# EAGLE design gluecksrad (EAGLE 6.6.0)
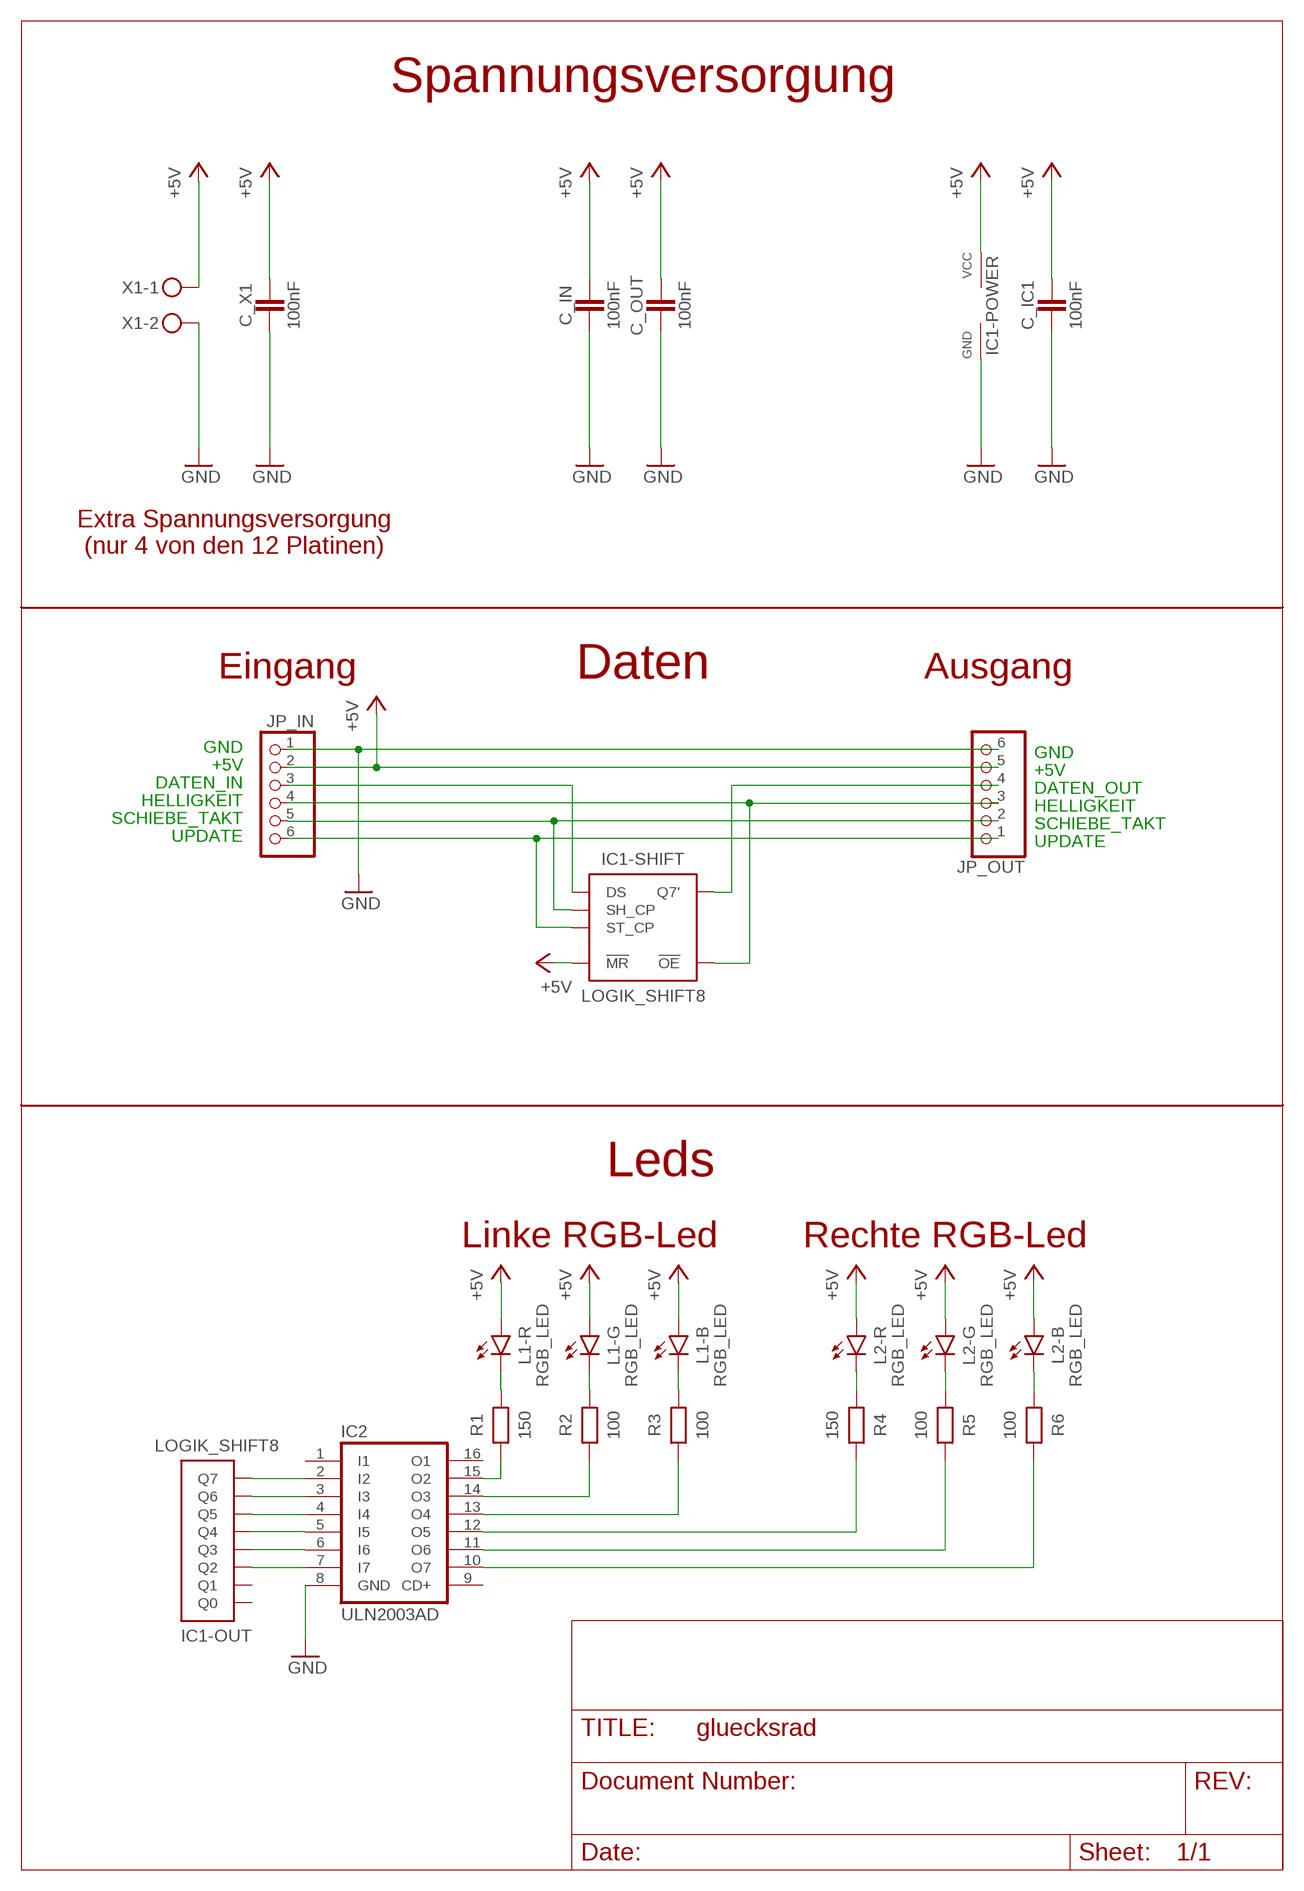
[diagram p0: schematic, sheet 1]

## Parts
C_IC1  100nF  CAPACITATOR-2,5MM  [C_THT_2]
C_IN  100nF  CAPACITATOR-2,5MM  [C_THT_2]
C_OUT  100nF  CAPACITATOR-2,5MM  [C_THT_2]
C_X1  100nF  CAPACITATOR-2,5MM  [C_THT_2]
IC1  LOGIK_SHIFT8  [IC_SOIC16]
IC2  ULN2003AD  [SO16]
JP_IN  PINHD-1X6/90  [1X06/90]
JP_OUT  PINHD-1X6/90  [1X06/90]
L1  RGB_LED  LED_3X  [LED_TOP_PLCC6]
L2  RGB_LED  LED_3X  [LED_TOP_PLCC6]
R1  150  RESISTOR-10MM  [R_THT_4]
R2  100  RESISTOR-10MM  [R_THT_4]
R3  100  RESISTOR-10MM  [R_THT_4]
R4  150  RESISTOR-10MM  [R_THT_4]
R5  100  RESISTOR-10MM  [R_THT_4]
R6  100  RESISTOR-10MM  [R_THT_4]
X1  STECKER_SPG_2  [STECKER_SPG_2]

## Nets
+5V: C_IC1.1 C_IN.1 C_OUT.1 C_X1.1 IC1.P$10(-SHIFT:!MR) IC1.P$16(-POWER:VCC) JP_IN.2 JP_OUT.5 L1.1(-R:A) L1.3(-G:A) L1.4(-B:A) L2.1(-R:A) L2.3(-G:A) L2.4(-B:A) X1.1
DATEN_IN: IC1.P$14(-SHIFT:DS) JP_IN.3
DATEN_OUT: IC1.P$9(-SHIFT:Q7') JP_OUT.4
GND: C_IC1.2 C_IN.2 C_OUT.2 C_X1.2 IC1.P$8(-POWER:GND) IC2.8(GND) JP_IN.1 JP_OUT.6 X1.2
HELLIGKEIT: IC1.P$13(-SHIFT:!OE) JP_IN.4 JP_OUT.3
N$1: IC1.P$5(-OUT:Q5) IC2.4(I4)
N$2: IC1.P$6(-OUT:Q6) IC2.3(I3)
N$3: IC1.P$2(-OUT:Q2) IC2.7(I7)
N$4: IC1.P$7(-OUT:Q7) IC2.2(I2)
N$5: IC1.P$3(-OUT:Q3) IC2.6(I6)
N$6: IC2.15(O2) R1.2
N$7: IC2.14(O3) R2.2
N$8: IC2.13(O4) R3.2
N$9: IC2.12(O5) R4.1
N$10: IC2.11(O6) R5.1
N$11: IC2.10(O7) R6.1
N$12: L1.6(-R:C) R1.1
N$13: L1.2(-G:C) R2.1
N$14: L1.5(-B:C) R3.1
N$15: L2.6(-R:C) R4.2
N$16: L2.2(-G:C) R5.2
N$17: L2.5(-B:C) R6.2
N$18: IC1.P$4(-OUT:Q4) IC2.5(I5)
SCHIEBE_TAKT: IC1.P$11(-SHIFT:SH_CP) JP_IN.5 JP_OUT.2
UPDATE: IC1.P$12(-SHIFT:ST_CP) JP_IN.6 JP_OUT.1
Unconnected: IC1.P$1(-OUT:Q1) IC1.P$15(-OUT:Q0) IC2.1(I1) IC2.9(CD+) IC2.16(O1)

## Notes on the sheet
- Spannungsversorgung
- Extra Spannungsversorgung
  (nur 4 von den 12 Platinen)
- Eingang | Daten | Ausgang
- Leds
- Linke RGB-Led | Rechte RGB-Led

## Library data of the parts
C_IC1 C_IN C_OUT C_X1 = robo_ag:CAPACITATOR: Kondensator
IC1 = robo_ag:LOGIK_SHIFT8: Logikgatter Reichelt: SMD HC 595 Schieberegister 8bit 5V
IC2 = uln-udn:ULN2003A: DRIVER ARRAY
JP_IN JP_OUT = pinhead:PINHD-1X6: PIN HEADER
L1 L2 = robo_ag:LED_3X: Led Reichelt: LRTB G6TG 280/900/180 mcd 2,1/3,2/3,2 V 20mA RGB-Led SMD
R1-R6 = robo_ag:RESISTOR: Widerstand Reichelt: METALL x,xx[k]
X1 = robo_ag:STECKER_SPG_2: Anschlussklemme Reichelt:AKL 101-02 Nicht Anreihbar Reichelt:AKL 057-02 Anreihbar

## Board
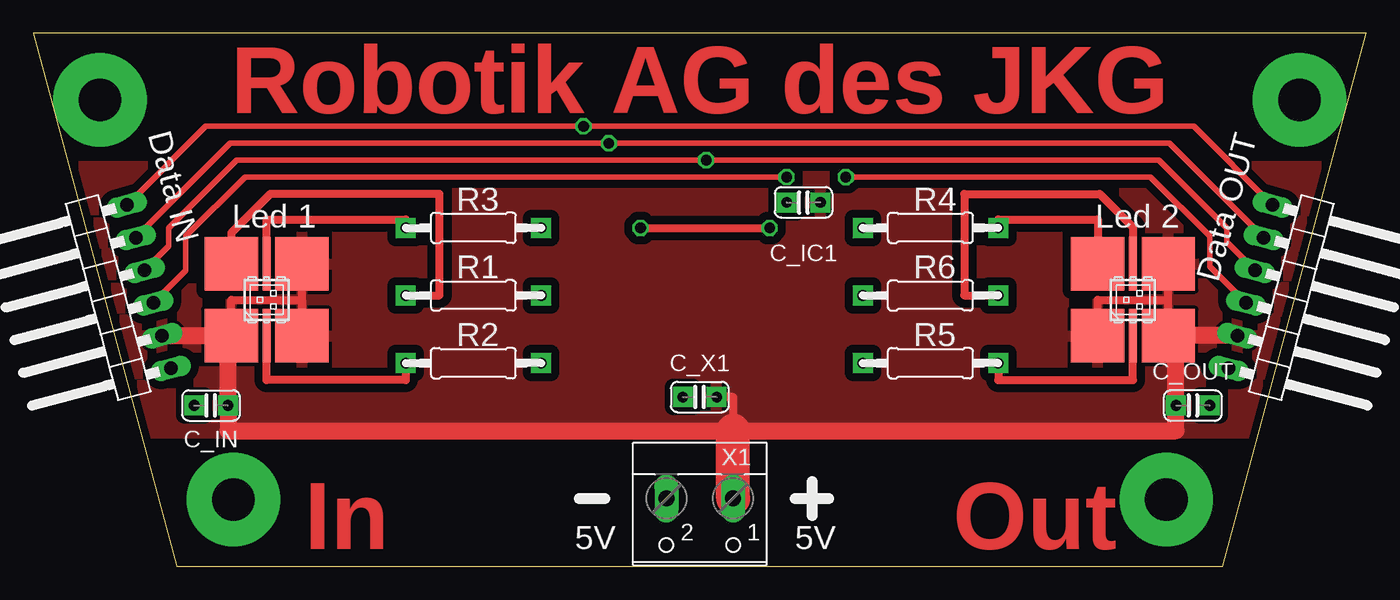
[diagram p1: board, top side]
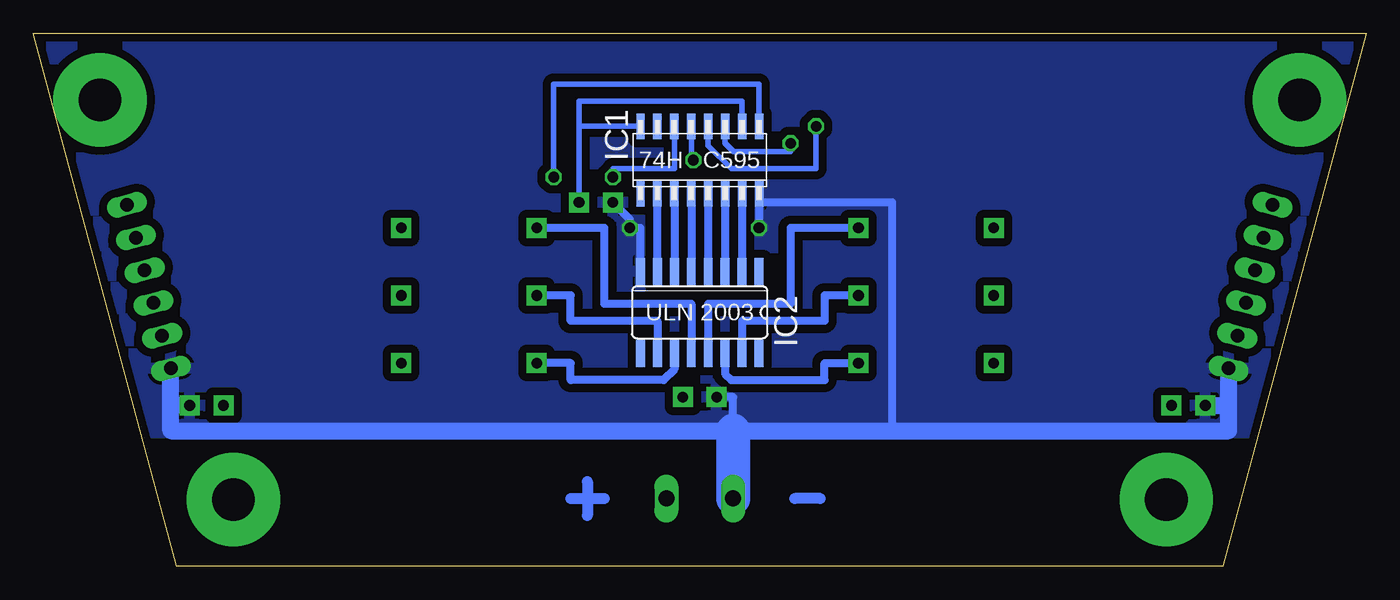
[diagram p2: board, bottom side, seen from below]

Size 100 x 40 mm. Coordinates in mm from the lower left corner, seen from the top.
Outline: 10.75,0 89.25,0 100,40 0,40 10.75,0
Copper layers (1*16): Top 0.035mm / dielectric 1.6mm / Bottom 0.035mm
Design rules "Elecrow_2-layer_PCB_eagle_rule": minimum track width 6mil, minimum drill 12mil, track to track 6mil, track to pad 6mil, pad to pad 6mil, via to via 8mil, smd to smd 0mil, copper to edge 20mil, drill to drill 10mil, minimum pad ring 6mil, minimum via ring 6mil, stop-mask expansion 0mil, vias tented up to drill 100mil, thermal gap 10mil

### Footprints (pad centres in the part's own frame; a part is rotated, then mirrored left to right if it is on the bottom)
C_THT_2 = drill 0.8 pad 1.5 square: 1 -1.27,0; 2 1.27,0
IC_SOIC16 = smd 1.905 x 0.635: P$1 -2.54,4.445; P$2 -2.54,3.175; P$3 -2.54,1.905; P$4 -2.54,0.635; P$5 -2.54,-0.635; P$6 -2.54,-1.905; P$7 -2.54,-3.175; P$8 -2.54,-4.445; P$9 2.54,-4.445; P$10 2.54,-3.175; P$11 2.54,-1.905; P$12 2.54,-0.635; P$13 2.54,0.635; P$14 2.54,1.905; P$15 2.54,3.175; P$16 2.54,4.445
SO16 = smd 0.66 x 2.032: 1 -4.445,-3.073; 2 -3.175,-3.073; 3 -1.905,-3.073; 4 -0.635,-3.073; 5 0.635,-3.073; 6 1.905,-3.073; 7 3.175,-3.073; 8 4.445,-3.073; 9 4.445,3.073; 10 3.175,3.073; 11 1.905,3.073; 12 0.635,3.073; 13 -0.635,3.073; 14 -1.905,3.073; 15 -3.175,3.073; 16 -4.445,3.073
1X06/90 = drill 1.016 long: 1 -6.35,-3.81; 2 -3.81,-3.81; 3 -1.27,-3.81; 4 1.27,-3.81; 5 3.81,-3.81; 6 6.35,-3.81
LED_TOP_PLCC6 = smd 4 x 4: 1 -2.65,-2.7; 3 2.65,-2.7; 4 2.65,2.7; 6 -2.65,2.7 | smd 0.6 x 4: 2 0,-2.7; 5 0,2.7
R_THT_4 = drill 0.8 pad 1.5 square: 1 -5.08,0; 2 5.08,0
STECKER_SPG_2 = drill 1.194 long: 1 -2.5,-1.27; 2 2.5,-1.27

### Placement (x,y rotation side)
C_IC1  57.78,27.3 180 top
C_IN  13.34,12.06 180 top
C_OUT  87,12.06 0 top
C_X1  50,12.7 180 top
IC1  50,30.48 90 bottom
IC2  50,19.05 180 bottom
JP_IN  5,20 105 top
JP_OUT  95,20 255 top
L1  17.5,20 0 top
L2  82.5,20 0 top
R1  33.02,20.32 0 top
R2  33.02,15.24 0 top
R3  33.02,25.4 0 top
R4  67.31,25.4 0 top
R5  67.31,15.24 0 top
R6  67.31,20.32 0 top
X1  50,3.81 180 top

### Tracks (layer width: path | path; a pad name or v marks a point on that pad's centre or on a via)
+5V
  Top 0.61: L1.4 L1.3 20.15,20 14.85,20 L1.1 14.61,17.31 | L2.1 79.85,20 85.15,20 L2.4 L2.3 | L2.3 | 85.72,17.3 L2.3 | C_X1.1 52.5,12.7 52.5,10.16
  Top 1.27: JP_IN.2 14.61,17.31 C_IN.1 14.61,10.16 52.5,10.16 85.72,10.16 C_OUT.1 85.72,17.3 | JP_OUT.5 L2.3
  Top 2.54: X1.1 52.5,10.16
  Bottom 0.406: IC1.P$10 46.83,34.92 59.05,34.92 59.05,33.02 | 59.05,33.02 C_IC1.1 | IC1.P$16 59.05,33.02
  pour Top (isolate 0.61): 2.54,30 8,10 92,10 97.46,30
DATEN_IN  (via drill 0.8)
  Top 0.406: JP_IN.3 11.43,22.18 11.43,24.77 15.88,29.21 v56.52,29.21
  Bottom 0.406: v56.52,29.21 56.52,29.84 51.91,29.84 IC1.P$14
DATEN_OUT  (via drill 0.8)
  Top 0.406: JP_OUT.4 88.27,22.48 88.27,24.77 83.82,29.21 v60.96,29.21
  Bottom 0.406: v60.96,29.21 60.96,36.2 45.55,36.2 IC1.P$9
GND  (via drill 0.8)
  Top 0.61: v45.55,25.4 v55.24,25.4
  Bottom 0.61: IC2.8 54.45,25.4 v55.24,25.4 55.24,26.04 C_IC1.2 | IC1.P$8 45.55,27.3 | 45.55,27.3 v45.55,25.4 | 47.5,10.16 47.5,12.7 C_X1.2 | 35.56,10.16 35.56,27.3 45.55,27.3
  Bottom 1.27: C_IN.2 10.32,12.06 | 10.32,12.06 JP_IN.1 | C_OUT.2 89.68,12.06 | 89.68,12.06 JP_OUT.6 | 10.32,12.06 10.32,10.16 35.56,10.16 47.5,10.16 89.68,10.16 89.68,12.06
  Bottom 2.54: 47.5,10.16 X1.2
  pour Bottom (isolate 0.61): 0,40 8,10 92,10 100,40
HELLIGKEIT  (via drill 0.8)
  Top 0.406: JP_IN.4 10.16,24.02 10.16,25.4 15.24,30.48 v50.48,30.48 84.45,30.48 89.53,25.4 89.53,24.33 JP_OUT.3
  Bottom 0.406: IC1.P$13 50.63,30.48 v50.48,30.48
N$1
  Bottom 0.61: IC1.P$5 IC2.4
N$2
  Bottom 0.61: IC1.P$6 IC2.3
N$3
  Bottom 0.61: IC2.7 IC1.P$2
N$4
  Bottom 0.61: IC1.P$7 IC2.2
N$5
  Bottom 0.61: IC1.P$3 IC2.6
N$6
  Bottom 0.61: R1.2 40.64,20.32 40.64,18.41 46.83,18.41 IC2.15
N$7
  Bottom 0.61: IC2.14 48.09,14.44 47.62,13.97 40.64,13.97 40.64,15.24 R2.2
N$8
  Bottom 0.61: R3.2 43.18,25.4 43.18,19.68 49.37,19.68 IC2.13
N$9
  Bottom 0.61: R4.1 57.15,25.4 57.15,19.68 50.63,19.68 IC2.12
N$10
  Bottom 0.61: IC2.11 51.91,14.77 52.7,13.97 59.69,13.97 59.69,15.24 R5.1
N$11
  Bottom 0.61: R6.1 59.69,20.32 59.69,18.41 53.17,18.41 IC2.10
N$12
  Top 0.61: R1.1 30.48,20.32 30.48,27.94 17.78,27.94 14.85,25.01 L1.6
N$13
  Top 0.61: R2.1 27.94,13.97 17.5,13.97 L1.2
N$14
  Top 0.61: L1.5 17.5,26.04 27.94,26.04 R3.1
N$15
  Top 0.61: 79.85,22.86 L2.6 79.85,26.04 72.39,26.04 R4.2
N$16
  Top 0.61: R5.2 72.39,13.97 82.5,13.97 L2.2
N$17
  Top 0.61: R6.2 69.85,20.32 69.85,27.94 80.01,27.94 82.5,25.45 L2.5
N$18
  Bottom 0.61: IC1.P$4 IC2.5
N$19
  Bottom 0.813: 40.96,5.08 42.86,5.08
N$21
  Bottom 0.813: 59.69,5.08 58.42,5.08 | 58.42,5.08 57.15,5.08 | 58.42,5.08 58.42,3.81 | 58.42,6.35 58.42,5.08
N$22  (via drill 3.2 pad 7)
  other vias: 15,5
N$23  (via drill 3.2 pad 7)
  other vias: 5,35
N$24  (via drill 3.2 pad 7)
  other vias: 85,5
N$25  (via drill 3.2 pad 7)
  other vias: 95,35
N$26
  Top 0.813: 40.96,5.08 42.86,5.08
N$27
  Top 0.813: 57.15,5.08 58.42,5.08 | 58.42,5.08 59.69,5.08 | 58.42,5.08 58.42,3.81 | 58.42,6.35 58.42,5.08
SCHIEBE_TAKT  (via drill 0.8)
  Top 0.406: JP_IN.5 14.78,31.75 v43.18,31.75 85.22,31.75 JP_OUT.2
  Bottom 0.406: v43.18,31.75 43.18,31.11 47.46,31.11 48.09,31.75 IC1.P$11
UPDATE  (via drill 0.8)
  Top 0.406: JP_IN.6 12.94,33.02 v41.27,33.02 87.06,33.02 JP_OUT.1
  Bottom 0.406: v41.27,33.02 41.27,29.84 47.62,29.84 49.37,31.59 IC1.P$12

### Text on the board
Top: Robotik AG des JKG | Robotik AG des JKG | In | Out
tNames: Data IN | R3 | R4 | Led 1 | Led 2 | R1 | R6 | Data OUT | R2 | R5 | 5V | 5V
bNames: IC1 | 74H C595 | IC2 | ULN 2003